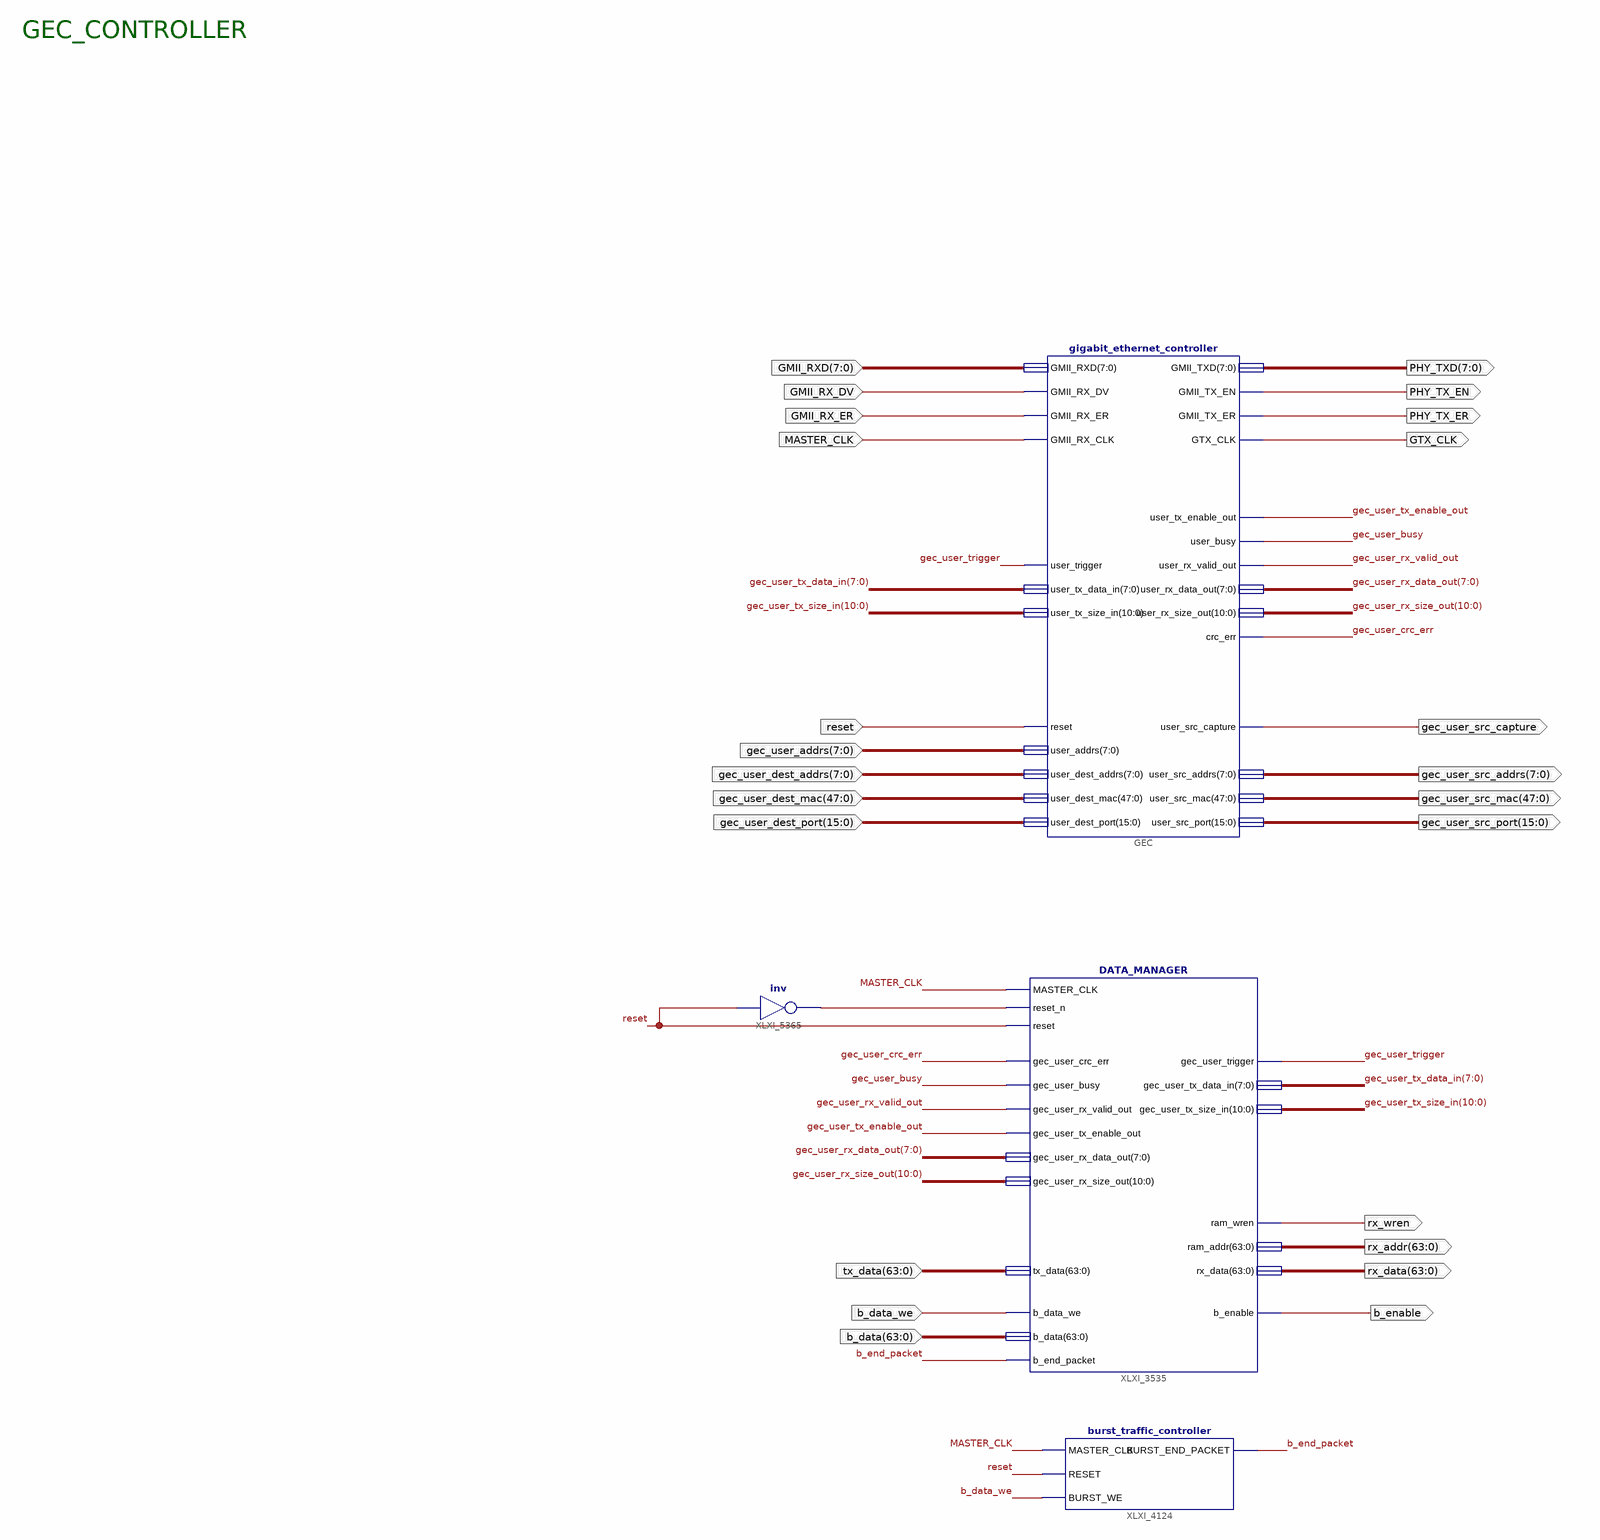
[diagram p0: schematic sheet 1]
// Xilinx ISE schematic Ethernet_Interface.sch (virtex4) as structural Verilog: 4 symbols, 24 ports
module Ethernet_Interface (
  input  MASTER_CLK,
  input  reset,
  input  b_data_we,
  input  [63:0] b_data,
  input  [63:0] tx_data,
  input  GMII_RX_DV,
  input  GMII_RX_ER,
  input  [7:0] GMII_RXD,
  input  [7:0] gec_user_addrs,
  input  [7:0] gec_user_dest_addrs,
  input  [47:0] gec_user_dest_mac,
  input  [15:0] gec_user_dest_port,
  output [63:0] rx_data,
  output [63:0] rx_addr,
  output rx_wren,
  output b_enable,
  output GTX_CLK,
  output PHY_TX_EN,
  output [7:0] PHY_TXD,
  output PHY_TX_ER,
  output gec_user_src_capture,
  output [7:0] gec_user_src_addrs,
  output [47:0] gec_user_src_mac,
  output [15:0] gec_user_src_port
);

  wire b_end_packet, gec_user_busy, gec_user_crc_err, gec_user_rx_valid_out, gec_user_trigger,
       gec_user_tx_enable_out, XLXN_15874;
  wire [7:0] gec_user_rx_data_out, gec_user_tx_data_in;
  wire [10:0] gec_user_rx_size_out, gec_user_tx_size_in;

  DATA_MANAGER XLXI_3535 (
    .reset(reset), .MASTER_CLK(MASTER_CLK), .reset_n(XLXN_15874),
    .gec_user_rx_size_out(gec_user_rx_size_out), .gec_user_crc_err(gec_user_crc_err),
    .gec_user_rx_valid_out(gec_user_rx_valid_out), .gec_user_rx_data_out(gec_user_rx_data_out),
    .gec_user_busy(gec_user_busy), .gec_user_tx_enable_out(gec_user_tx_enable_out), .b_data_we(b_data_we),
    .tx_data(tx_data), .b_data(b_data), .b_end_packet(b_end_packet), .rx_data(rx_data), .ram_wren(rx_wren),
    .ram_addr(rx_addr), .gec_user_tx_data_in(gec_user_tx_data_in), .gec_user_tx_size_in(gec_user_tx_size_in),
    .gec_user_trigger(gec_user_trigger), .b_enable(b_enable));
  not XLXI_5365 (XLXN_15874, reset);
  gigabit_ethernet_controller GEC (
    .user_tx_data_in(gec_user_tx_data_in), .user_tx_size_in(gec_user_tx_size_in),
    .user_addrs(gec_user_addrs), .GMII_RXD(GMII_RXD), .GMII_RX_CLK(MASTER_CLK),
    .user_trigger(gec_user_trigger), .reset(reset), .GMII_RX_DV(GMII_RX_DV), .GMII_RX_ER(GMII_RX_ER),
    .user_dest_addrs(gec_user_dest_addrs), .user_dest_mac(gec_user_dest_mac),
    .user_dest_port(gec_user_dest_port), .user_rx_size_out(gec_user_rx_size_out), .GMII_TX_EN(PHY_TX_EN),
    .GMII_TX_ER(PHY_TX_ER), .GTX_CLK(GTX_CLK), .user_busy(gec_user_busy),
    .user_rx_valid_out(gec_user_rx_valid_out), .user_tx_enable_out(gec_user_tx_enable_out),
    .user_rx_data_out(gec_user_rx_data_out), .GMII_TXD(PHY_TXD), .user_src_addrs(gec_user_src_addrs),
    .crc_err(gec_user_crc_err), .user_src_capture(gec_user_src_capture), .user_src_mac(gec_user_src_mac),
    .user_src_port(gec_user_src_port));
  burst_traffic_controller XLXI_4124 (
    .MASTER_CLK(MASTER_CLK), .RESET(reset), .BURST_WE(b_data_we), .BURST_END_PACKET(b_end_packet));

  // Notes on the sheet:
  //   GEC_CONTROLLER
endmodule
